# Altium project PCB_Attempt_2.PrjPcb
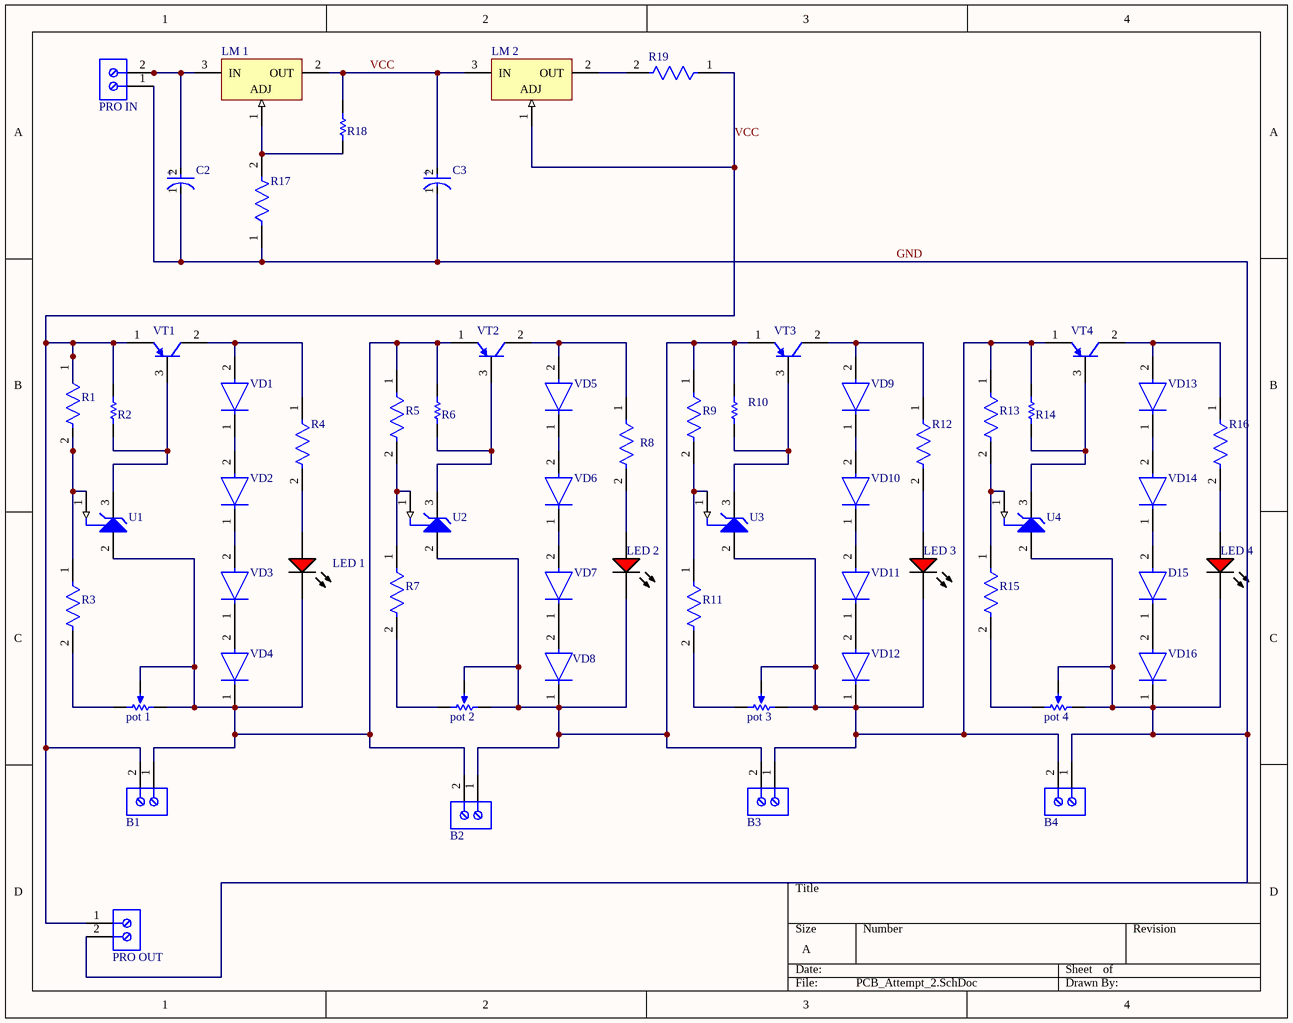
[diagram p0: PCB_Attempt_2.SchDoc]
1 sheet, 61 parts. Net scope: global (net labels, ports and power ports of the same name join across sheets).
Board file: PCB_Attempt_2.PcbDoc

## Sheet PCB_Attempt_2.SchDoc
size A; SheetNumber: 1; SheetTotal: 3

### Parts
B1  282836-2  [TECO-282836-2_V]  (value not drawn)
B2  282836-2  [TECO-282836-2_V]  (value not drawn)
B3  282836-2  [TECO-282836-2_V]  (value not drawn)
B4  282836-2  [TECO-282836-2_V]  (value not drawn)
C2  EEU-FR1H101B  [FP-EEU-FR1H101B-MFG]  (value not drawn)
C3  EEU-FR1H101B  [FP-EEU-FR1H101B-MFG]  (value not drawn)
D15  1N4007  [FP-1N4007-MFG]  (value not drawn)
LED_1  HSMH-C190  [AVAG-HSMX-C190_V]  (value not drawn)
LED_2  HSMH-C190  [AVAG-HSMX-C190_V]  (value not drawn)
LED_3  HSMH-C190  [AVAG-HSMX-C190_V]  (value not drawn)
LED_4  HSMH-C190  [AVAG-HSMX-C190_V]  (value not drawn)
LM_1  LM317T  [TO-220]  (value not drawn)
LM_2  LM317T  [TO-220]  (value not drawn)
pot_1  3006P-1-203ZLF  [BOUR-3006P-3_V]  (value not drawn)
pot_2  3006P-1-203ZLF  [BOUR-3006P-3_V]  (value not drawn)
pot_3  3006P-1-203ZLF  [BOUR-3006P-3_V]  (value not drawn)
pot_4  3006P-1-203ZLF  [BOUR-3006P-3_V]  (value not drawn)
PRO_IN  282836-2  [TECO-282836-2_V]  (value not drawn)
PRO_OUT  282836-2  [TECO-282836-2_V]  (value not drawn)
R1  RT1206DRD0720KL  [FP-RT1206-MFG]  (value not drawn)
R2  CRCW08051K00FKEB  [RESC2013X50X30ML20T20]  (value not drawn)
R3  RT1206DRD0720KL  [FP-RT1206-MFG]  (value not drawn)
R4  CRGP0805F330R  [FP-CRGP0805-IPC_C]  (value not drawn)
R5  RT1206DRD0720KL  [FP-RT1206-MFG]  (value not drawn)
R6  CRCW08051K00FKEB  [RESC2013X50X30ML20T20]  (value not drawn)
R7  RT1206DRD0720KL  [FP-RT1206-MFG]  (value not drawn)
R8  CRGP0805F330R  [FP-CRGP0805-IPC_C]  (value not drawn)
R9  RT1206DRD0720KL  [FP-RT1206-MFG]  (value not drawn)
R10  CRCW08051K00FKEB  [RESC2013X50X30ML20T20]  (value not drawn)
R11  RT1206DRD0720KL  [FP-RT1206-MFG]  (value not drawn)
R12  CRGP0805F330R  [FP-CRGP0805-IPC_C]  (value not drawn)
R13  RT1206DRD0720KL  [FP-RT1206-MFG]  (value not drawn)
R14  CRCW08051K00FKEB  [RESC2013X50X30ML20T20]  (value not drawn)
R15  RT1206DRD0720KL  [FP-RT1206-MFG]  (value not drawn)
R16  CRGP0805F330R  [FP-CRGP0805-IPC_C]  (value not drawn)
R17  RG2012P-242-B-T5  [FP-RG2012-MFG]  (value not drawn)
R18  RK73H2ATTD2400F  [RESC2013X60X30NL20T20]  (value not drawn)
R19  ESR10EZPF2R00  [FP-ESR10-IPC_B]  (value not drawn)
U1  TL431CLP  [LP0003A]  (value not drawn)
U2  TL431CLP  [LP0003A]  (value not drawn)
U3  TL431CLP  [LP0003A]  (value not drawn)
U4  TL431CLP  [LP0003A]  (value not drawn)
VD1  1N4007  [FP-1N4007-MFG]  (value not drawn)
VD2  1N4007  [FP-1N4007-MFG]  (value not drawn)
VD3  1N4007  [FP-1N4007-MFG]  (value not drawn)
VD4  1N4007  [FP-1N4007-MFG]  (value not drawn)
VD5  1N4007  [FP-1N4007-MFG]  (value not drawn)
VD6  1N4007  [FP-1N4007-MFG]  (value not drawn)
VD7  1N4007  [FP-1N4007-MFG]  (value not drawn)
VD8  1N4007  [FP-1N4007-MFG]  (value not drawn)
VD9  1N4007  [FP-1N4007-MFG]  (value not drawn)
VD10  1N4007  [FP-1N4007-MFG]  (value not drawn)
VD11  1N4007  [FP-1N4007-MFG]  (value not drawn)
VD12  1N4007  [FP-1N4007-MFG]  (value not drawn)
VD13  1N4007  [FP-1N4007-MFG]  (value not drawn)
VD14  1N4007  [FP-1N4007-MFG]  (value not drawn)
VD16  1N4007  [FP-1N4007-MFG]  (value not drawn)
VT1  BD136G  [ONSC-TO-225-3-77-09]  (value not drawn)
VT2  BD136G  [ONSC-TO-225-3-77-09]  (value not drawn)
VT3  BD136G  [ONSC-TO-225-3-77-09]  (value not drawn)
VT4  BD136G  [ONSC-TO-225-3-77-09]  (value not drawn)

### Nets
GND: B4.1 C2.1(C) C3.1(C) LED_4.2(K) pot_4.2(WIPER) pot_4.3(CW) PRO_IN.1 PRO_OUT.2 R17.1 U4.2(ANODE) VD16.1(C)
VCC: B1.2 C3.2(A) LM_1.2(OUT) LM_2.1(ADJ) LM_2.3(IN) PRO_OUT.1 R1.1 R2.2 R18.2 R19.1 VT1.1(E)
NetB1_1: B1.1 B2.2 LED_1.2(K) pot_1.2(WIPER) pot_1.3(CW) R5.1 R6.2 U1.2(ANODE) VD4.1(C) VT2.1(E)
NetB2_1: B2.1 B3.2 LED_2.2(K) pot_2.2(WIPER) pot_2.3(CW) R9.1 R10.2 U2.2(ANODE) VD8.1(C) VT3.1(E)
NetB3_1: B3.1 B4.2 LED_3.2(K) pot_3.2(WIPER) pot_3.3(CW) R13.1 R14.2 U3.2(ANODE) VD12.1(C) VT4.1(E)
NetC2_2: C2.2(A) LM_1.3(IN) PRO_IN.2
NetD15_1: D15.1(C) VD16.2(A)
NetD15_2: D15.2(A) VD14.1(C)
NetLED_1_1: LED_1.1(A) R4.2
NetLED_2_1: LED_2.1(A) R8.2
NetLED_3_1: LED_3.1(A) R12.2
NetLED_4_1: LED_4.1(A) R16.2
NetLM_1_1: LM_1.1(ADJ) R17.2 R18.1
NetLM_2_2: LM_2.2(OUT) R19.2
Netpot_1_1: pot_1.1(CCW) R3.2
Netpot_2_1: pot_2.1(CCW) R7.2
Netpot_3_1: pot_3.1(CCW) R11.2
Netpot_4_1: pot_4.1(CCW) R15.2
NetR1_2: R1.2 R3.1 U1.1(REF)
NetR2_1: R2.1 U1.3(CATHODE) VT1.3(B)
NetR4_1: R4.1 VD1.2(A) VT1.2(C)
NetR5_2: R5.2 R7.1 U2.1(REF)
NetR6_1: R6.1 U2.3(CATHODE) VT2.3(B)
NetR8_1: R8.1 VD5.2(A) VT2.2(C)
NetR9_2: R9.2 R11.1 U3.1(REF)
NetR10_1: R10.1 U3.3(CATHODE) VT3.3(B)
NetR12_1: R12.1 VD9.2(A) VT3.2(C)
NetR13_2: R13.2 R15.1 U4.1(REF)
NetR14_1: R14.1 U4.3(CATHODE) VT4.3(B)
NetR16_1: R16.1 VD13.2(A) VT4.2(C)
NetVD1_1: VD1.1(C) VD2.2(A)
NetVD2_1: VD2.1(C) VD3.2(A)
NetVD3_1: VD3.1(C) VD4.2(A)
NetVD5_1: VD5.1(C) VD6.2(A)
NetVD6_1: VD6.1(C) VD7.2(A)
NetVD7_1: VD7.1(C) VD8.2(A)
NetVD9_1: VD9.1(C) VD10.2(A)
NetVD10_1: VD10.1(C) VD11.2(A)
NetVD11_1: VD11.1(C) VD12.2(A)
NetVD13_1: VD13.1(C) VD14.2(A)

### Notes on the sheet
- (in symbol CMP-05427-000020-1) +

### Library data of the parts
B1-B4 PRO_IN PRO_OUT = CMP-1684-00017-1: Female Header, Pitch 5 mm, 1 x 2 Position, Height 10 mm, Tail Length 3.5 mm, Rohs, Bulk; Manufacturer: TE Connectivity; Wire Gauge: 16-30AWG; Product Training Modules: Wire-to-BoardEurostyleTerminalBlocks; Clamp Material - Plating: Brass-NickelPlated; Voltage: 300V; Mating Orientation: HorizontalwithBoard; Current: 13.5A; Pitch: 0.197"(5.00mm); Screw Thread: M3; 3D Model: 282836-2.pdf; Other Names: 5ULV-02B / A98076; Dynamic Catalog: BuchananSeries; Number of Levels: 1; Torque - Screw: 0.68Nm(6Lb-In); Featured Product: EurostyleTerminalBlockConnectors; Positions Per Level: 2; Wire Termination: Screw-RisingCageClamp; Datasheet URL: http://www.te.com.cn/commerce/DocumentDelivery/DDEController?Action=showdoc&DocId=Catalog+Section%7F1308389_EUROSTYLE_TERMINAL_BLOCKS%7F0607%7Fpdf%7FEnglish%7FENG_CS_1308389_EUROSTYLE_TERMINAL_BLOCKS_0607.pdf%7F282836-2; Color: Green; Family: TerminalBlocks-WiretoBoard; RoHS Information: 282836-2StatementofCompliance; Standard Package: 300; Contact Material - Plating: Brass-TinPlated; Manufacturer URL: http://www.te.com; Housing Material: Polyamide(PA66),Nylon6/6; Features: Interlocking(Side); Package Description: Female Header, Pitch 5 mm, 1 x 2 Position, Height 10 mm, Tail Length 3.5 mm; Mounting Type: ThroughHole; Package Reference: THD; Packaging: Bulk; Series: Buchanan; Category: Connectors,Interconnects; Screw Material - Plating: Brass-NickelPlated
C2 C3 = CMP-05427-000020-1: CAP ALUM 100UF 20% 50V RADIAL; Life (Hours): 6000Hour; Ripple Current: 870mA; Lead Diameter: 0.6mm; Impedance: 61mR; Tolerance: 20%; Mount: Through Hole; Lead Free: Lead Free; Length: 11.5mm; Height - Seated (Max): 0.512inch; Contact Plating: Tin; Termination: Radial; Series: FR; Max Operating Temperature: 105°C; Features: General Purpose; Min Operating Temperature: -40°C; RoHS Compliant: Yes; Height: 11.5mm; Voltage Rating (DC): 50V; Diameter: 8mm; Capacitance: 100uF; Lead Pitch: 5mm; Radiation Hardening: No; Package Quantity: 1; Case/Package: Radial; Voltage Rating: 50V; Packaging: Tape and Reel; ESR (Equivalent Series Resistance): 61mR; REACH SVHC: No SVHC; Value: 100uF
D15 VD1-VD14 VD16 = CMP-123542-000001-1: Rectifier diode 1000 V 1 A DO-41, ,; Manufacturer: Diotec; Max Surge Forward Current: 27A; Forward Current: 1A; Max Junction Temp: +175°C; Reverse Voltage: 1000V; Value: 15pF; Peak Reverse Current: 5uA; Category: Diode; Temperature Range Low: -50°C; Automotive: No; Temperature: -50°C to +175°C; Lead Free: Yes; ComponentLink2Description: Datasheet; Max Repetitive Reverse Voltage: 1000V; ComponentLink2URL: https://datasheet.octopart.com/1N4007-Diotec-datasheet-62346875.pdf; Manufacturer Part Number: 1N4007; Device Class L3: Rectifier Diodes; Height: 2.8mm; Octopart: https://octopart.com/1n4007-diotec-4040411; Package: 1N4007; Temperature Range High: +175°C; Device Class L1: Discrete Semiconductors; Device Class L2: Diodes; RoHS: TRUE; Capacitance: 15pF; Ipc Land Pattern Name: DIOAD888W100L520D280
LED_1-LED_4 = CMP-1744-00004-1: LED Uni-Color Red, 65 mW, 20 mA, -40 to 85 degC, 2-Pin SMD, RoHS, Tape and Reel; Connector Type: USB; Gender: Male; Current Rating: 1 A; Length: 7.5 mm; Lead Pitch: 0.65 mm; PackageReference: HSMX-C190; Package Quantity: 2000; Max Operating Temperature: 85 degC; PackageDescription: 2-Pin Surface Mount Device, Body 1.6 x 0.8 mm, Height 0.9 mm; ComponentLink3Description: Package Specification; Mount: Surface Mount; Min Operating Temperature: -30 degC; ComponentLink3URL: http://www.fairchildsemi.com/dwg/MA/MA03D.pdf; ComponentLink1Description: Manufacturer URL; Contact Material: Copper; Pins: 5; Width: 5.6 mm; ComponentLink2Description: Datasheet; RoHSCompliant: true; DatasheetVersion: Mar-12; Height: 2.8 mm; Packaging: Tape and Reel; Contact Plating: Gold; ComponentLink1URL: http://www.avagotech.com/; REACH SVHC: No SVHC; ComponentLink2URL: http://docs.avagotech.com/docs/AV02-0551EN
LM_1 LM_2 = CMP-0244-00444-1: 1.5A, 1.2V to 37V Adjustable Voltage Regulator, 3-Pin TO-220; PackageVersion: 2011; ComponentLink1URL: http://www.st.com; ComponentLink2URL: http://www.st.com/internet/com/TECHNICAL_RESOURCES/TECHNICAL_LITERATURE/DATASHEET/CD00000455.pdf; PackageDescription: TO, Thru-Hole, Vertical, Heatsink Mounted; 3 In-Line Leads; Pitch 2.54 mm; PackageReference: TO-220; ComponentLink1Description: Manufacturer URL; ComponentLink3URL: http://www.st.com/internet/com/TECHNICAL_RESOURCES/TECHNICAL_LITERATURE/PACKAGE_INFORMATION/CD00004649.pdf; DatasheetVersion: 1/11/2011; ComponentLink2Description: Datasheet; ComponentLink3Description: Package Specification
pot_1-pot_4 = CMP-0972-00011-2: Trimming Potentiometer, 20K Ohm +/- 10%, -55 to 125 degC, 3-Pin 19.05 x 4.83 x 6.6 mm THD, RoHS; Manufacturer: Bourns; Rotational Life: 200 Cycles; Resistance Tolerance: +/- 10%; Resistance (kOhm): 20; Number of Turns: 15; ComponentLink3Description: Package Specification; ComponentLink3URL: http://www.bourns.com/data/global/pdfs/3006.pdf; PackageVersion: Apr-14; PackageDescription: 3-Pin THD, Body 19.05 x 4.83 mm, Height 6.6 mm; ComponentLink1URL: http://www.bourns.com/; PartNumber: 3006P-1-203ZLF; ComponentLink2Description: Datasheet; PackageReference: 3006P-3; ComponentLink1Description: Manufacturer URL; DatasheetVersion: Apr-14; ComponentLink2URL: http://www.bourns.com/data/global/pdfs/3006.pdf; Temperature Range: -55 to 125 degC; Mounting Technology: Through Hole; RoHS: TRUE
R1 R3 R5 R7 R9 R11 R13 R15 = CMP-03412-020597-1: RES SMD 20K OHM 0.5% 1/4W 1206; Manufacturer: Yageo; Tolerance: 0.0001; Value: 20KΩ; Power Rating: 0.25W; Temperature Coefficient: 25 ppm/°C; Voltage Rating: 200V; Package: RT1206; ComponentLink2URL: http://www.yageo.com/documents/recent/PYu-RT_1-to-0.01_RoHS_L_9.pdf; Category: Res; Series: RT; Footprint Url: http://www.yageo.com/exep/pages/download/literatures/PYu-R_Mount_10.pdf; Device Class L2: Resistors; Device Class L1: Passive Components; Temperature: -55°C to +155°C; Composition: Thin Film; Octopart: https://octopart.com/rt1206drd0720kl-yageo-1404362; ComponentLink2Description: Datasheet; Device Class L3: Chip SMD Resistors; Temperature Range High: +155°C; Automotive: No; Ipc Land Pattern Name: RESC310160X55; Resistance: 20KΩ; Lead Free: Yes; RoHS: TRUE; Manufacturer Part Number: RT1206DRD0720KL; Digikey Description: RES SMD 20K OHM 0.5% 1/4W 1206; Temperature Range Low: -55°C; Height: 0.65mm
R2 R6 R10 R14 = CMP-2001-03596-1: Manufacturer: Vishay Dale; Part Number: CRCW08051K00FKEB
R4 R8 R12 R16 = CMP-03211-004931-1: CRGP 0805 330R 1%; Manufacturer: TE; Resistance: 330Ω; Power Rating: 0.33W; Value: 330Ω; Tolerance: 0.01; Voltage Rating: 150V; Temperature Coefficient: ±100ppm/°C; Device Class L1: Passive Components; Ipc Land Pattern Name: RESC200125X55; Octopart: https://octopart.com/crgp0805f330r-te+connectivity-91018812; Package: CRGP0805; Ambient Temperature Range High: +70°C; Manufacturer Part Number: CRGP0805F330R; Lead Free: Yes; Temperature Range Low: -55°C; Series: CRGP; Temperature: -55°C to +155°C; RoHS: TRUE; Automotive: No; Category: Res; ComponentLink2URL: https://www.mouser.com/datasheet/2/418/NG_DS_9-1773463-9_A-1358566.pdf; Digikey Description: CRGP 0805 330R 1%; Temperature Range High: +155°C; ComponentLink2Description: Datasheet; Device Class L2: Resistors; Composition: Thick Film; Height: 0.65mm; Device Class L3: Chip SMD Resistors
R17 = CMP-2001-02857-2: Automotive Metal Thin Film Chip Resistor, 0805, 2.4kΩ, 0.1%, 25ppm/°C, 0.125W, 150V; Resistance: 2.4kR; Max Power Dissipation: 125mW; Value: 2.4kR; Tolerance: 0.1%; Package Quantity: 1; Temperature Coefficient: 25ppm/°C; Features: Automotive AEC-Q200; Weight: 0.000194oz; Series: RG; Lead Free: Lead Free; Voltage Rating: 150V; RoHS Compliant: Yes; Case/Package: 0805; Max Operating Temperature: 155°C; Case Code (Imperial): 0805; Height: 0.02inch; Number of Terminations: 2; Width: 0.049inch; Power Rating: 125mW; Termination: SMD/SMT; Packaging: Tape and Reel; Voltage Rating (DC): 150V; Resistor Type: Thin Film; Min Operating Temperature: -55°C; Case Code (Metric): 2012; Length: 0.079inch
R18 = CMP-2001-02232-1: Manufacturer: KOA Speer; Part Number: RK73H2ATTD2400F
R19 = CMP-08839-028930-1: 2Ω ±1% 0.4W 0805 Anti-Surge Chip Resistor AEC-Q200; Max Power Dissipation: 400mW; Temperature Coefficient: 100ppm/°C; Resistance: 2R; Value: 2R; Number of Terminations: 2; Package Quantity: 1; Features: Automotive AEC-Q200; Tolerance: 1%; Length: 0.079inch; Series: ESR; RoHS Compliant: Yes; Packaging: Tape and Reel; Max Operating Temperature: 155°C; Height: 0.026inch; Resistor Type: Thick Film; Min Operating Temperature: -55°C; Width: 0.049inch; Case/Package: 0805; Case Code (Metric): 2012; Case Code (Imperial): 0805
U1-U4 = CMP-0366-00032-2: Adjustable Precision Shunt Regulator, 34 ppm / degC, 100 mA, 0 to 70 degC, 3-pin TO-92 (LP), Pb-Free (RoHS); Manufacturer: Texas Instruments; Iout/Iz(Max)(mA): 100; SubFamily: Shunt Voltage Reference; Initial Accuracy @ 25/deg C(%): 2; VO Adj(Max)(V): 36; Temp Coeff(Max)(ppm/ degree C): 92; Temp Coeff(Typ)(ppm/ degree C): 34; Min Iz for Regulation(uA): 600; VO Adj(Min)(V): 2.495; Rating: Military; ComponentLink2Description: Datasheet; PackageReference: LP0003A; ComponentLink1URL: http://www.ti.com/; PackageDescription: Plastic Cylindrical Package, Formed Lead Option (TO-92); Code_JEDEC: TO-226; PartNumber: TL431CLP; ComponentLink2URL: http://www.ti.com/general/docs/lit/getliterature.tsp?genericPartNumber=TL431&fileType=pdf; Eco-Plan: Pb-Free (RoHS); DatasheetVersion: SLVS543M; Mounting Technology: Through Hole; ComponentLink3Description: Package Specification; ComponentLink1Description: Manufacturer URL; PackageVersion: 4040001-2/C; ComponentLink3URL: http://www.ti.com/litv/pdf/msot002a
VT1-VT4 = CMP-1048-01274-1: Plastic Medium-Power Silicon PNP Transistor, 3-Pin TO-225, Pb-Free, Bulk Box; Manufacturer: On Semiconductor; IC Continuous (A): 1.5; PackageReference: TO-225-3-77-09; DatasheetVersion: Rev. 15; Polarity: PNP; PackageDescription: 3-Pin Flange Mount, Vertical Straight Lead, Body 7.6 x 2.7 mm, Pitch 2.29 mm; ComponentLink1URL: http://www.onsemi.com/; PackageVersion: Rev. AC, 12/2013; Packing: Bulk Box; RoHS: TRUE; ComponentLink1Description: Manufacturer URL; ComponentLink3URL: http://www.onsemi.com/pub_link/Collateral/77-09.PDF; ComponentLink2URL: http://www.onsemi.com/pub_link/Collateral/BD136-D.PDF; PartNumber: BD136G; ComponentLink2Description: Datasheet; ComponentLink3Description: Package Specification; Mounting Technology: Through Hole